# EAGLE design Hocki-Control (EAGLE 9.6.2)
Integrates sensors and microcontroller for battlebot Hocki
REVISION: 1.0; SCH_DESC: Control Board for Hocki Battlebot; TEAM: BattleBots

## Sheet 1 of 3: MCU, I/O, Power
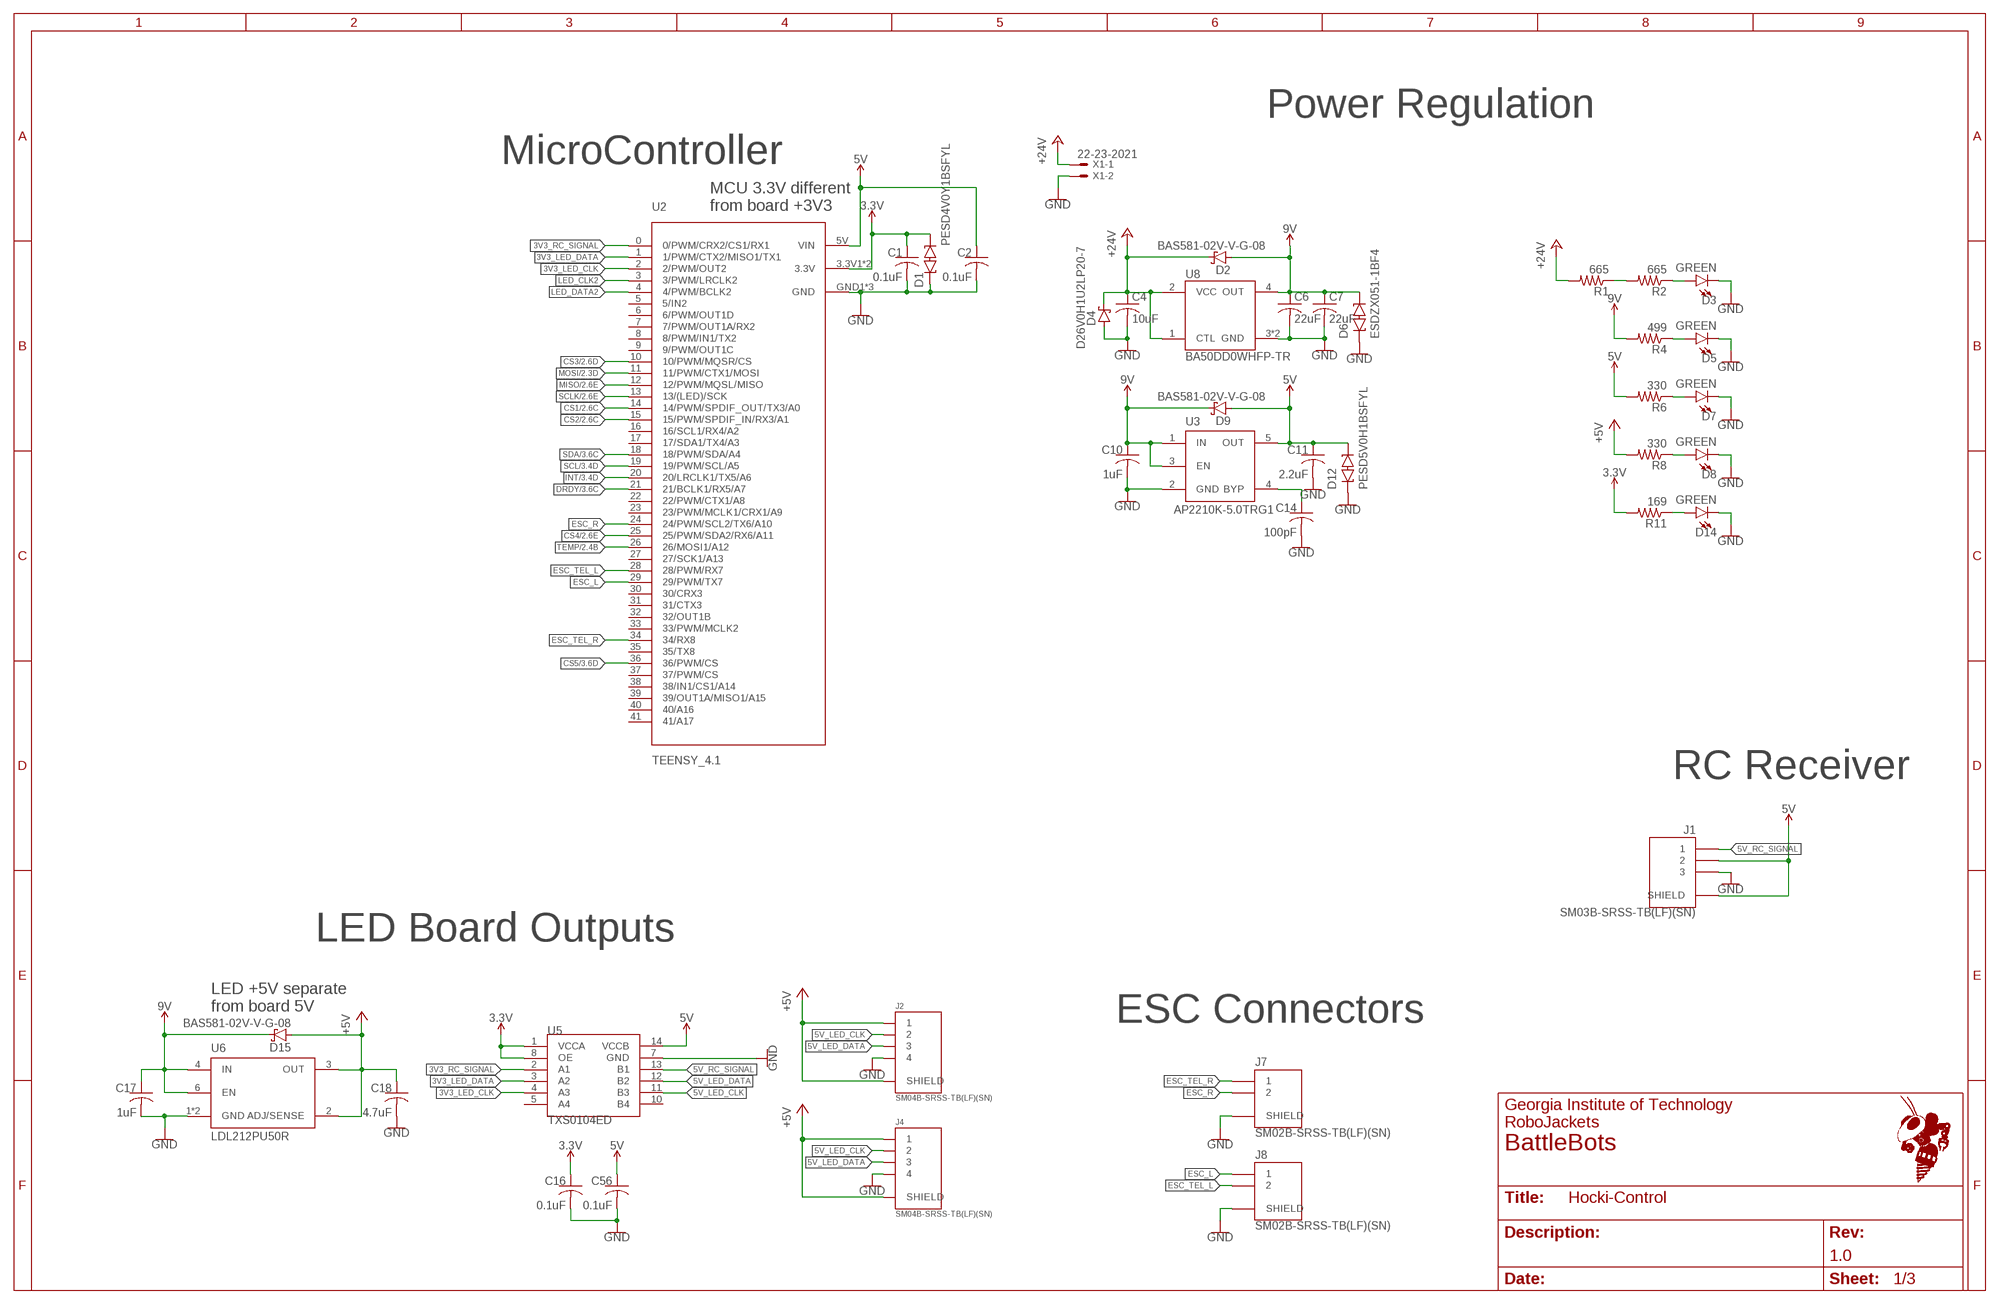
[diagram p0: schematic, sheet 1]

### Parts
C1  0.1uF  C-USC0603  [C0603]
C2  0.1uF  C-USC0603  [C0603]
C4  10uF  C-USC1206  [C1206]
C6  22uF  C-USC1206  [C1206]
C7  22uF  C-USC1206  [C1206]
C10  1uF  C-USC0603  [C0603]
C11  2.2uF  C-USC0603  [C0603]
C14  100pF  C-USC0603  [C0603]
C16  0.1uF  C-USC0603  [C0603]
C17  1uF  C-USC0603  [C0603]
C18  4.7uF  C-USC0603  [C0603]
C56  0.1uF  C-USC0603  [C0603]
D1  PESD4V0Y1BSFYL  [DSN0603-2]
D2  BAS581-02V-V-G-08  [SOD-523]
D3  GREEN  LED-GREEN0603  [LED-0603]
D4  D26V0H1U2LP20-7  [D26V0H1U2LP20-7]
D5  GREEN  LED-GREEN0603  [LED-0603]
D6  ESDZX051-1BF4  [DSN0603-2]
D7  GREEN  LED-GREEN0603  [LED-0603]
D8  GREEN  LED-GREEN0603  [LED-0603]
D9  BAS581-02V-V-G-08  [SOD-523]
D12  PESD5V0H1BSFYL  [DSN0603-2]
D14  GREEN  LED-GREEN0603  [LED-0603]
D15  BAS581-02V-V-G-08  [SOD-523]
J1  SM03B-SRSS-TB(LF)(SN)  [SM03B-SRSS-TB(LF)(SN)]
J2  SM04B-SRSS-TB(LF)(SN)  [SM04B-SRSS-TB(LF)(SN)]
J4  SM04B-SRSS-TB(LF)(SN)  [SM04B-SRSS-TB(LF)(SN)]
J7  SM02B-SRSS-TB(LF)(SN)  [SM02B-SRSS-TB(LF)(SN)]
J8  SM02B-SRSS-TB(LF)(SN)  [SM02B-SRSS-TB(LF)(SN)]
R1  665  R-US_R0603  [R0603]
R2  665  R-US_R0603  [R0603]
R4  499  R-US_R0603  [R0603]
R6  330  R-US_R0603  [R0603]
R8  330  R-US_R0603  [R0603]
R11  169  R-US_R0603  [R0603]
U2  TEENSY_4.1  [TEENSY_4.1]
U3  AP2210K-5.0TRG1  [SOT-23-5]
U5  TXS0104ED  [14-SOIC]
U6  LDL212PU50R  [DFN6(3X3)]
U8  BA50DD0WHFP-TR  [HRP5]
X1  22-23-2021  [22-23-2021]

### Nets
3.3V: C1.1 C16.1 D1.C2 R11.2 U2.3.3V1(3.3V) U2.3.3V2(3.3V) U5.1(VCCA) U5.8(OE) ; also sheet 2,3
3V3_LED_CLK: U2.2(2/PWM/OUT2) U5.4(A3)
3V3_LED_DATA: U2.1(1/PWM/CTX2/MISO1/TX1) U5.3(A2)
3V3_RC_SIGNAL: U2.0(0/PWM/CRX2/CS1/RX1) U5.2(A1)
5V: C2.1 C11.1 C56.1 D9.2(A) D12.C2 J1.2 J1.S1(SHIELD) J1.S2(SHIELD) R6.2 U2.5V(VIN) U3.5(OUT) U5.14(VCCB)
5V_LED_CLK: J2.2 J4.2 U5.11(B3)
5V_LED_DATA: J2.3 J4.3 U5.12(B2)
5V_RC_SIGNAL: J1.1 U5.13(B1)
9V: C6.1 C7.1 C10.1 C17.1 D2.2(A) D6.C2 D9.1(C) D15.1(C) R4.2 U3.1(IN) U3.3(EN) U6.4(IN) U6.6(EN) U8.4(OUT)
+5V: C18.1 D15.2(A) J2.1 J2.S1(SHIELD) J2.S2(SHIELD) J4.1 J4.S1(SHIELD) J4.S2(SHIELD) R8.2 U6.2(ADJ/SENSE) U6.3(OUT)
+24V: C4.1 D2.1(C) D4.1(C) R1.2 U8.1(CTL) U8.2(VCC) X1.1
CS1: U2.14(14/PWM/SPDIF_OUT/TX3/A0) ; also sheet 2
CS2: U2.15(15/PWM/SPDIF_IN/RX3/A1) ; also sheet 2
CS3: U2.10(10/PWM/MQSR/CS) ; also sheet 2
CS4: U2.25(25/PWM/SDA2/RX6/A11) ; also sheet 2
CS5: U2.36(36/PWM/CS) ; also sheet 3
DRDY: U2.21(21/BCLK1/RX5/A7) ; also sheet 3
ESC_L: J8.1 U2.29(29/PWM/TX7)
ESC_R: J7.2 U2.24(24/PWM/SCL2/TX6/A10)
ESC_TEL_L: J8.2 U2.28(28/PWM/RX7)
ESC_TEL_R: J7.1 U2.34(34/RX8)
GND: C1.2 C2.2 C4.2 C6.2 C7.2 C10.2 C11.2 C14.2 C16.2 C17.2 C18.2 C56.2 D1.C1 D3.C D4.2(A) D5.C D6.C1 D7.C D8.C D12.C1 D14.C J1.3 J2.4 J4.4 J7.S1(SHIELD) J7.S2(SHIELD) J8.S1(SHIELD) J8.S2(SHIELD) U2.GND1(GND) U2.GND2(GND) U2.GND3(GND) U3.2(GND) U5.7(GND) U6.1(GND) U6.7(GND) U8.3(GND) U8.6(GND) X1.2 ; also sheet 2,3
INT: U2.20(20/LRCLK1/TX5/A6) ; also sheet 3
LED_CLK2: U2.3(3/PWM/LRCLK2)
LED_DATA2: U2.4(4/PWM/BCLK2)
MISO: U2.12(12/PWM/MQSL/MISO) ; also sheet 2
MOSI: U2.11(11/PWM/CTX1/MOSI) ; also sheet 2
N$8: C14.1 U3.4(BYP)
N$14: D8.A R8.1
N$15: D7.A R6.1
N$18: D5.A R4.1
N$19: D3.A R2.1
N$20: R1.1 R2.2
N$27: D14.A R11.1
SCL: U2.19(19/PWM/SCL/A5) ; also sheet 3
SCLK: U2.13(13/(LED)/SCK) ; also sheet 2
SDA: U2.18(18/PWM/SDA/A4) ; also sheet 3
TEMP: U2.26(26/MOSI1/A12) ; also sheet 2
Unconnected: U2.5(5/IN2) U2.6(6/PWM/OUT1D) U2.7(7/PWM/OUT1A/RX2) U2.8(8/PWM/IN1/TX2) U2.9(9/PWM/OUT1C) U2.16(16/SCL1/RX4/A2) U2.17(17/SDA1/TX4/A3) U2.22(22/PWM/CTX1/A8) U2.23(23/PWM/MCLK1/CRX1/A9) U2.27(27/SCK1/A13) U2.30(30/CRX3) U2.31(31/CTX3) U2.32(32/OUT1B) U2.33(33/PWM/MCLK2) U2.35(35/TX8) U2.37(37/PWM/CS) U2.38(38/IN1/CS1/A14) U2.39(39/OUT1A/MISO1/A15) U2.40(40/A16) U2.41(41/A17) U5.5(A4) U5.10(B4)

### Notes on the sheet
- Power Regulation
- MicroController
- MCU 3.3V different
  from board +3V3
- RC Receiver
- LED Board Outputs
- LED +5V separate
  from board 5V
- ESC Connectors

## Sheet 2 of 3: Accelerometers
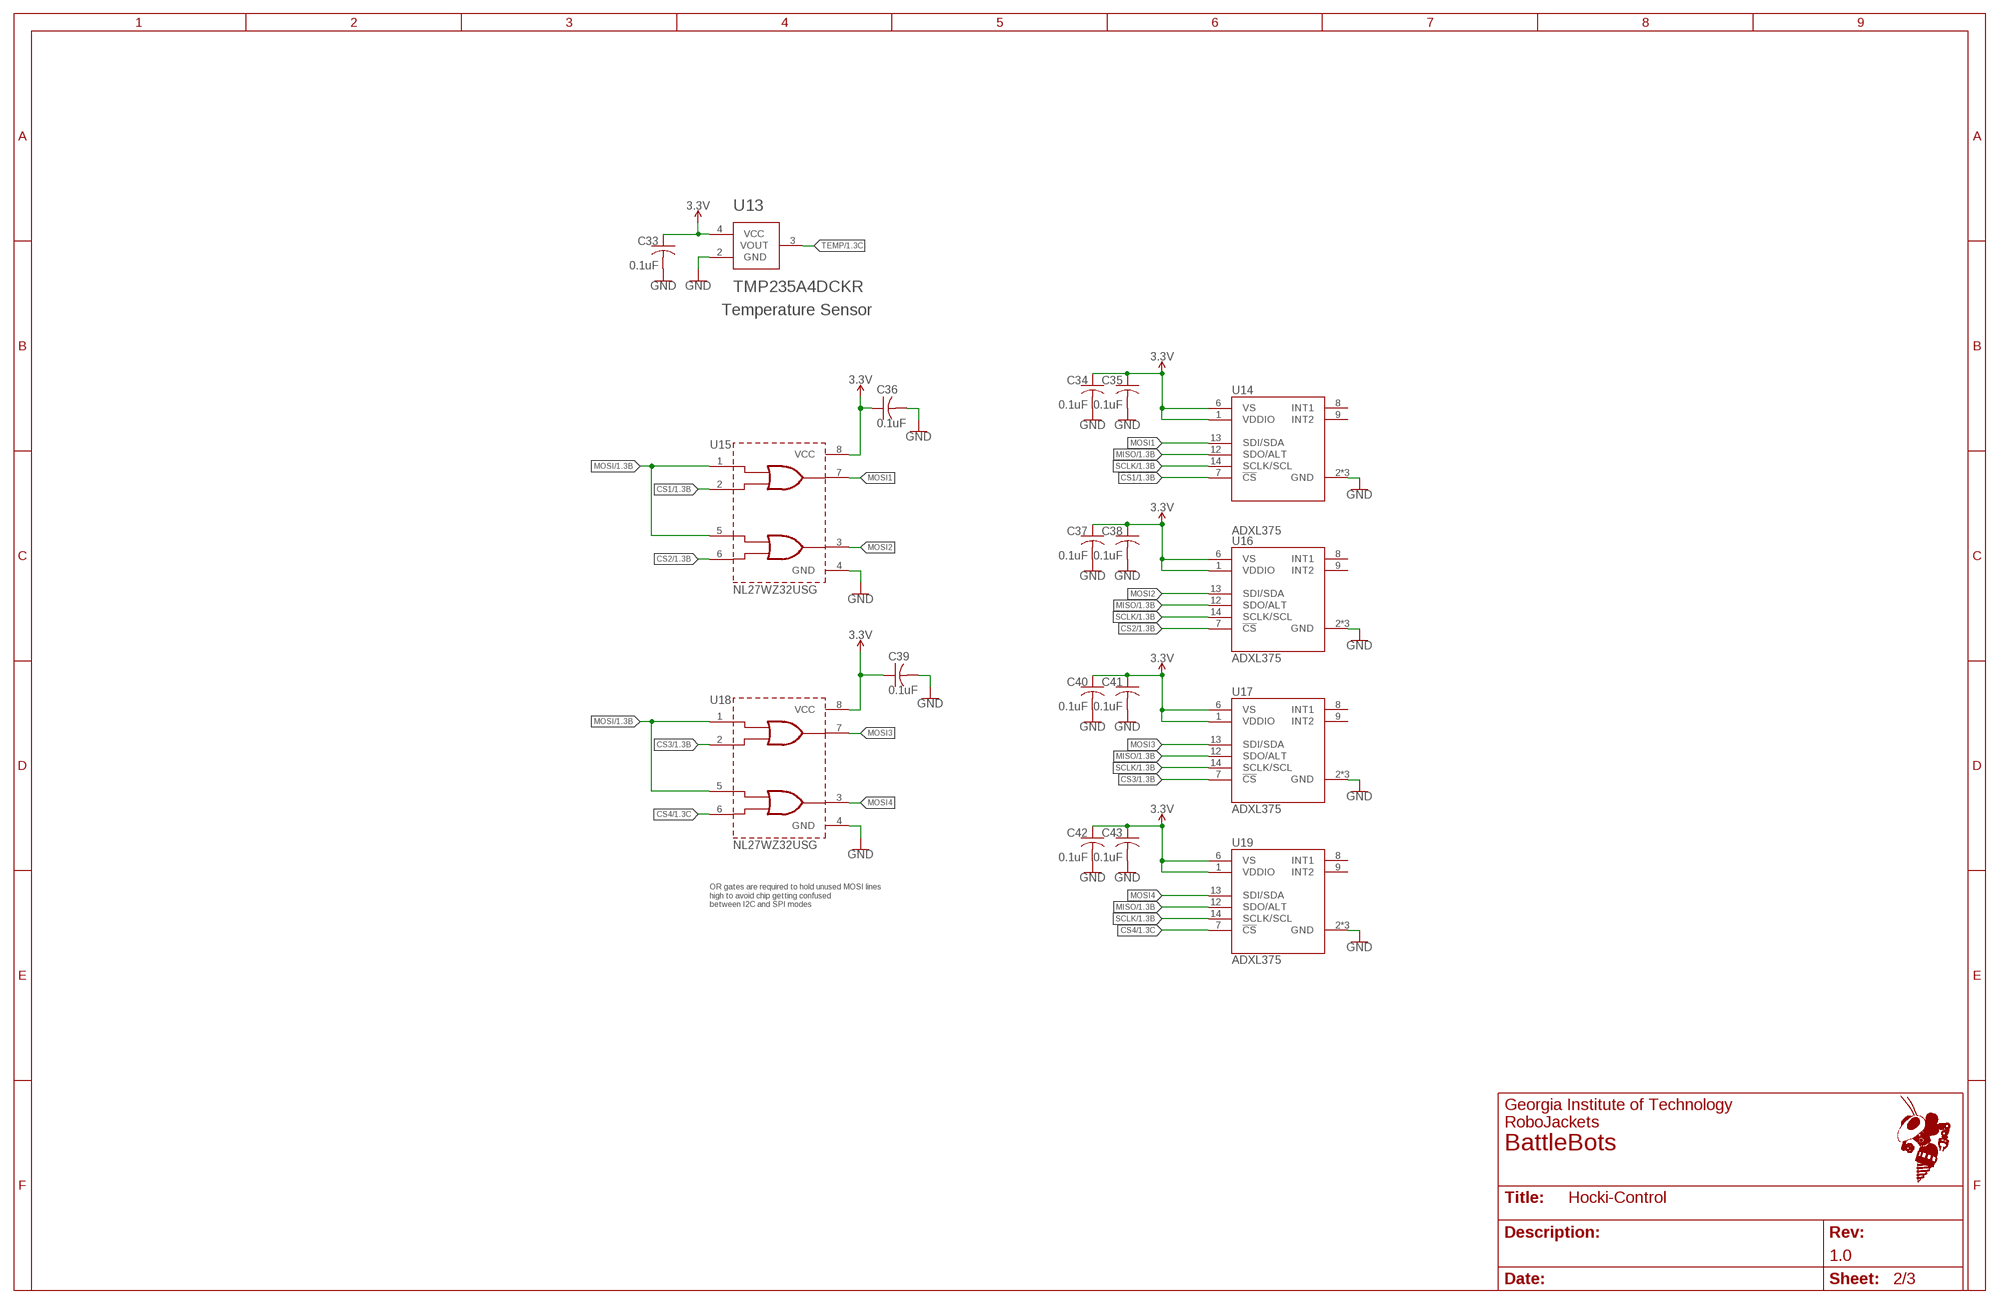
[diagram p1: schematic, sheet 2]

### Parts
C33  0.1uF  C-USC0603  [C0603]
C34  0.1uF  C-USC0603  [C0603]
C35  0.1uF  C-USC0603  [C0603]
C36  0.1uF  C-USC0603  [C0603]
C37  0.1uF  C-USC0603  [C0603]
C38  0.1uF  C-USC0603  [C0603]
C39  0.1uF  C-USC0603  [C0603]
C40  0.1uF  C-USC0603  [C0603]
C41  0.1uF  C-USC0603  [C0603]
C42  0.1uF  C-USC0603  [C0603]
C43  0.1uF  C-USC0603  [C0603]
U13  TMP235A4DCKR  [SOT-353]
U14  ADXL375  [14-LGA]
U15  NL27WZ32USG  [US8]
U16  ADXL375  [14-LGA]
U17  ADXL375  [14-LGA]
U18  NL27WZ32USG  [US8]
U19  ADXL375  [14-LGA]

### Nets
3.3V: C33.1 C34.1 C35.1 C36.1 C37.1 C38.1 C39.1 C40.1 C41.1 C42.1 C43.1 U13.4(VCC) U14.1(VDDIO) U14.6(VS) U15.8(VCC) U16.1(VDDIO) U16.6(VS) U17.1(VDDIO) U17.6(VS) U18.8(VCC) U19.1(VDDIO) U19.6(VS) ; also sheet 1,3
CS1: U14.7(!CS) U15.2(B1) ; also sheet 1
CS2: U15.6(B2) U16.7(!CS) ; also sheet 1
CS3: U17.7(!CS) U18.2(B1) ; also sheet 1
CS4: U18.6(B2) U19.7(!CS) ; also sheet 1
GND: C33.2 C34.2 C35.2 C36.2 C37.2 C38.2 C39.2 C40.2 C41.2 C42.2 C43.2 U13.2(GND) U14.2(GND) U14.4(GND) U14.5(GND) U15.4(GND) U16.2(GND) U16.4(GND) U16.5(GND) U17.2(GND) U17.4(GND) U17.5(GND) U18.4(GND) U19.2(GND) U19.4(GND) U19.5(GND) ; also sheet 1,3
MISO: U14.12(SDO/ALT) U16.12(SDO/ALT) U17.12(SDO/ALT) U19.12(SDO/ALT) ; also sheet 1
MOSI: U15.1(A1) U15.5(A2) U18.1(A1) U18.5(A2) ; also sheet 1
MOSI1: U14.13(SDI/SDA) U15.7(Y1)
MOSI2: U15.3(Y2) U16.13(SDI/SDA)
MOSI3: U17.13(SDI/SDA) U18.7(Y1)
MOSI4: U18.3(Y2) U19.13(SDI/SDA)
SCLK: U14.14(SCLK/SCL) U16.14(SCLK/SCL) U17.14(SCLK/SCL) U19.14(SCLK/SCL) ; also sheet 1
TEMP: U13.3(VOUT) ; also sheet 1
Unconnected: U14.8(INT1) U14.9(INT2) U16.8(INT1) U16.9(INT2) U17.8(INT1) U17.9(INT2) U19.8(INT1) U19.9(INT2)

### Notes on the sheet
- Temperature Sensor
- OR gates are required to hold unused MOSI lines 
  high to avoid chip getting confused 
  between I2C and SPI modes

## Sheet 3 of 3: Magnetometer
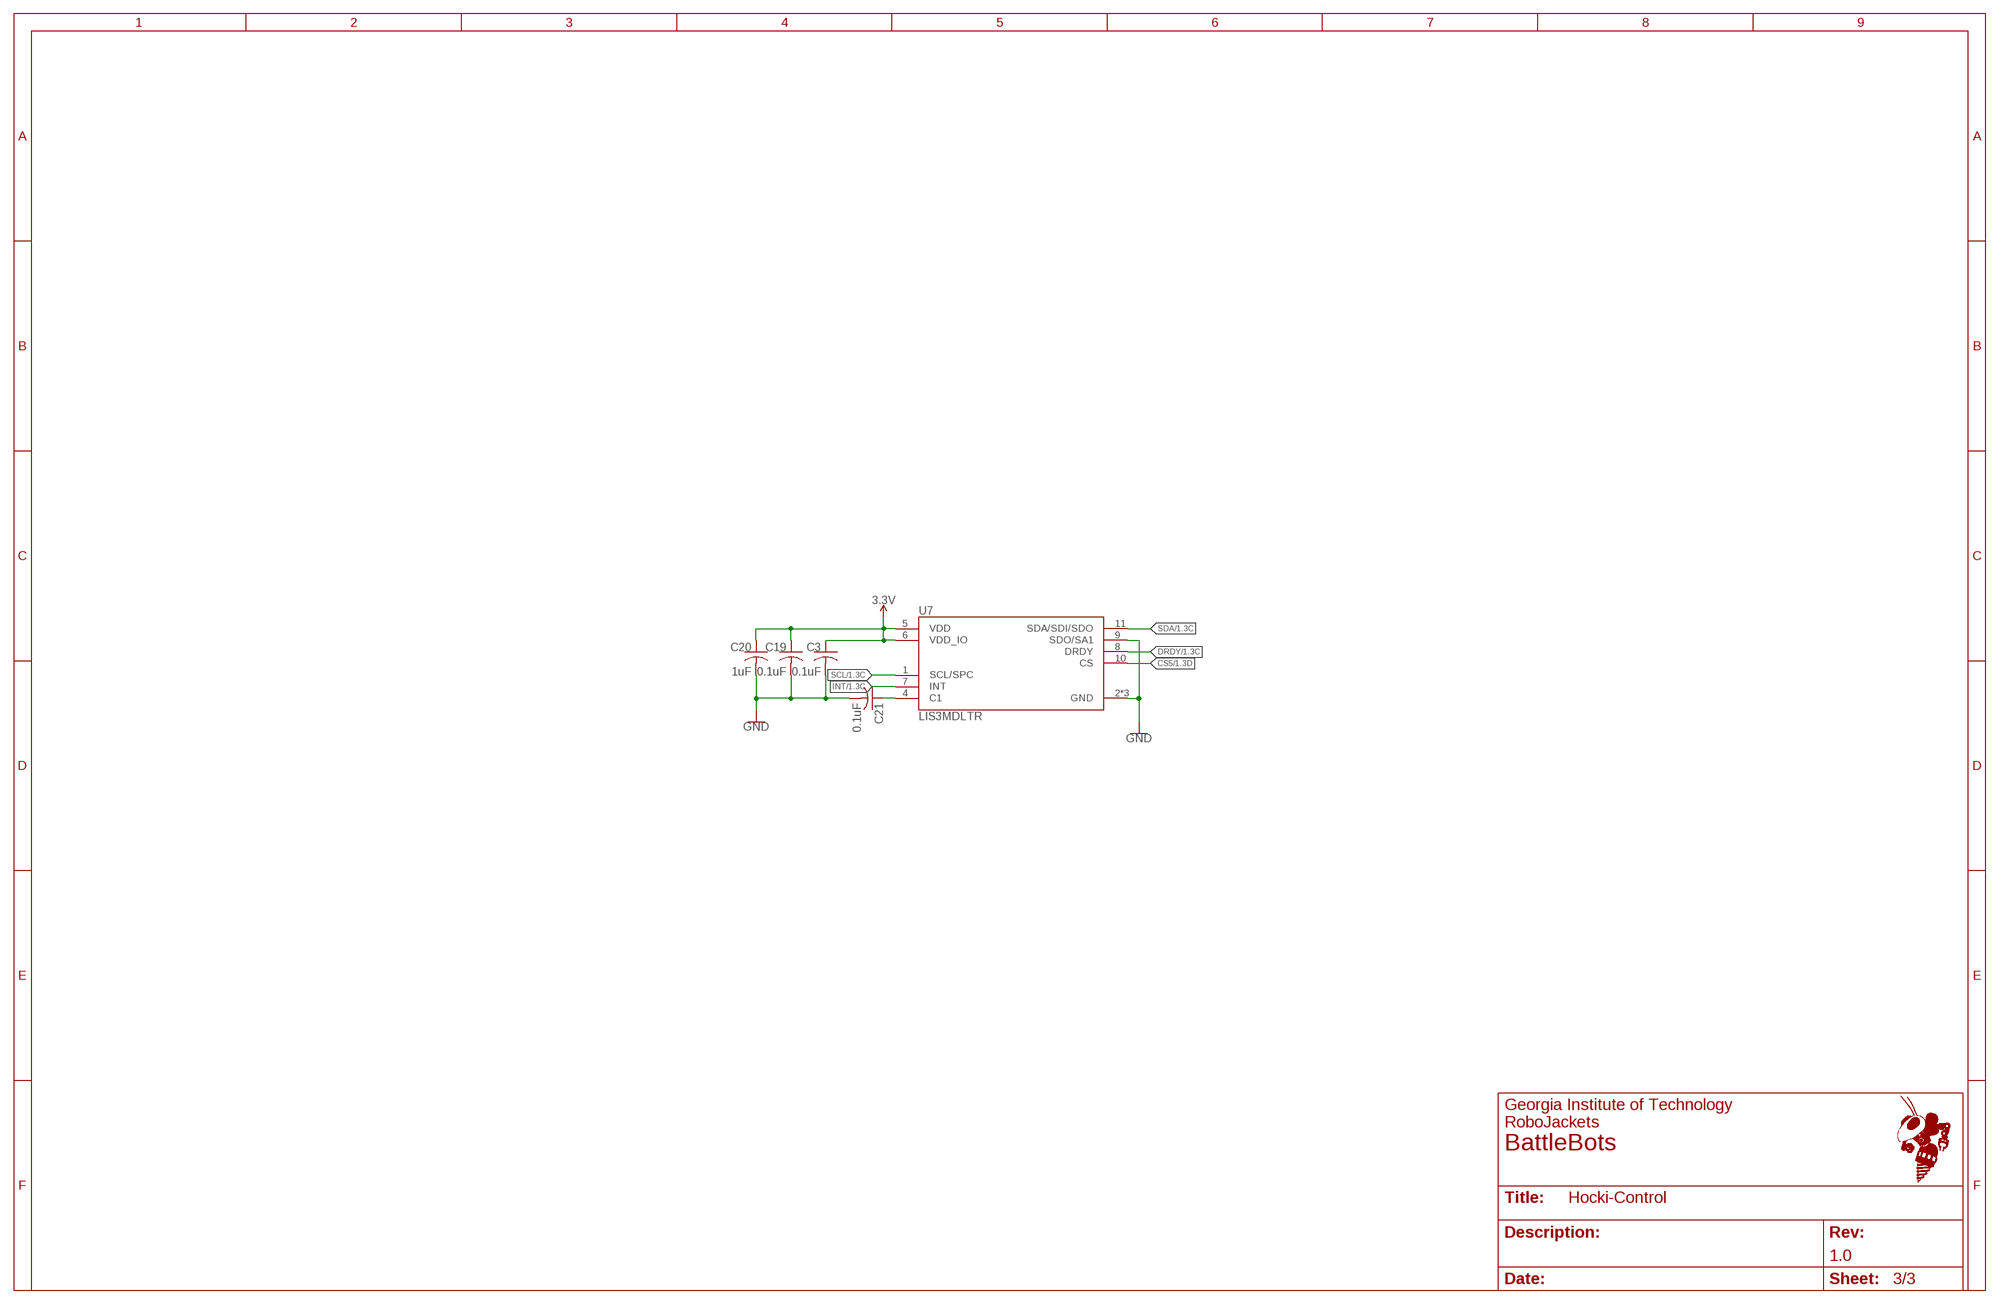
[diagram p2: schematic, sheet 3]

### Parts
C3  0.1uF  C-USC0603  [C0603]
C19  0.1uF  C-USC0603  [C0603]
C20  1uF  C-USC0603  [C0603]
C21  0.1uF  C-USC0603  [C0603]
U7  LIS3MDLTR  [LGA-12_2X2X1_STM]

### Nets
3.3V: C3.1 C19.1 C20.1 U7.5(VDD) U7.6(VDD_IO) ; also sheet 1,2
CS5: U7.10(CS) ; also sheet 1
DRDY: U7.8(DRDY) ; also sheet 1
GND: C3.2 C19.2 C20.2 C21.2 U7.2(GND) U7.3(GND) U7.9(SDO/SA1) U7.12(GND) ; also sheet 1,2
INT: U7.7(INT) ; also sheet 1
N$5: C21.1 U7.4(C1)
SCL: U7.1(SCL/SPC) ; also sheet 1
SDA: U7.11(SDA/SDI/SDO) ; also sheet 1

## Library data of the parts
C1-C4 C6 C7 C10 C11 C14 C16-C21 C33-C43 C56 = rcl:C-US: CAPACITOR, American symbol; SPICEPREFIX: C
D1 = Hocki_Library:PESD4V0Y1BSFYL: 3.7V (Typ) Clamp Ipp Tvs Diode Surface Mount DSN0603-2 DigiKey <https://www.digikey.com/product-detail/en/nexperia-usa-inc/PESD4V0Y1BSFYL/1727-7840-1-ND/9326518>; DKPN: 1727-7840-1-ND
D2 D9 D15 = Hocki_Library:BAS581-02V-V-G-08: Diode Schottky 40V 200mA Surface Mount SOD-523 DigiKey <https://www.digikey.com/product-detail/en/vishay-semiconductor-diodes-division/BAS581-02V-V-G-08/112-BAS581-02V-V-G-08CT-ND/8564684>; DKPN: 112-BAS581-02V-V-G-08CT-ND
D3 D5 D7 D8 D14 = SparkFun-LED:LED-GREEN: Green SMD LED Used in manufacturing of various products at SparkFun Packages: 0603 - SMD 0603 package [Product Link] <http://www.futureelectronics.com/en/technologies/semiconductors/optoelectronics/leds/Pages/9894312-LTST-C190GKT.aspx?CrossPart=HSMG-C190&IM=0> LilyPad 1206 - SMD1206 LilyPad package [Product Link] <http://www.futureelectronics.com/en/Technologies/Product.aspx?ProductID=IN150NGHARVATEKCORPORATION2049943&IM=0> 1206 - SMD1206 package [Product Link] <http://www.futureelectronics.com/en/technologies/semiconductors/optoelectronics/leds/Pages/8315665-LTST-C150KGKT.aspx?IM=0> 1206 Bottom Mount -SMD 1206 Bottom Mount [Product Link] <http://www.digikey.com/product-detail/en/lite-on-inc/LTST-C230KGKT/160-1456-1-ND/386854> SparkFun Products: Pro Mini 328 -5V <https://www.sparkfun.com/products/821> RedBoard <https://www.sparkfun.com/products/12757> MP3 Trigger <https://www.sparkfun.com/products/13720> Makey Makey <https://www.sparkfun.com/products/11076>; PROD_ID: DIO-00821
D4 = Hocki_Library:D26V0H1U2LP20-7: 40V Clamp 9.5A Ipp Tvs Diode Surface Mount U-DFN2020-2 DigiKey <https://www.digikey.com/product-detail/en/diodes-incorporated/D26V0H1U2LP20-7/D26V0H1U2LP20-7DICT-ND/4898881>
D6 = Hocki_Library:ESDZX051-1BF4: 10V (Typ) Clamp 4A (8/20µs) Ipp Tvs Diode Surface Mount ST0201 DigiKey <https://www.digikey.com/product-detail/en/stmicroelectronics/ESDZX051-1BF4/497-ESDZX051-1BF4CT-ND/12749584>; DKPN: 497-ESDZX051-1BF4CT-ND
D12 = Hocki_Library:PESD5V0H1BSFYL: 5V Clamp 7A (8/20µs) Ipp Tvs Diode Surface Mount DSN0603-2 DigiKey <https://www.digikey.com/product-detail/en/nexperia-usa-inc/PESD5V0H1BSFYL/1727-2675-1-ND/6576108>; DKPN: 1727-2675-1-ND
J1 = Hocki_Library:SM03B-SRSS-TB(LF)(SN): Connector Header Surface Mount, Right Angle 3 position 0.039" (1.00mm) DigiKey <https://www.digikey.com/product-detail/en/jst-sales-america-inc/SM03B-SRSS-TB-LF-SN/455-1803-1-ND/926874>; DKPN: 455-1803-1-ND
J2 J4 = Hocki_Library:SM04B-SRSS-TB(LF)(SN): Connector Header Surface Mount, Right Angle 4 position 0.039" (1.00mm) DigiKey <https://www.digikey.com/product-detail/en/jst-sales-america-inc/SM04B-SRSS-TB-LF-SN/455-1804-1-ND/926875>; DKPN: 455-1804-1-ND
J7 J8 = Hocki_Library:SM02B-SRSS-TB(LF)(SN): Connector Header Surface Mount, Right Angle 2 position 0.039" (1.00mm) DigiKey <https://www.digikey.com/product-detail/en/jst-sales-america-inc/SM02B-SRSS-TB-LF-SN/455-1802-1-ND/926873>; DKPN: 455-1802-1-ND
R1 R2 R4 R6 R8 R11 = rcl:R-US_: RESISTOR, American symbol; SPICEPREFIX: R
U2 = Hocki_Library:TEENSY_4.1: Teensy 4.1 features the fastest micocontroller and an expanded set of powerful peripherals in a 2.4 by 0.7 inch form factor. DigiKey <https://www.digikey.com/product-detail/en/sparkfun-electronics/DEV-16771/1568-DEV-16771-ND/12180099>; DKPN: 1568-DEV-16771-ND
U3 = Hocki_Library:AP2210K-*TRG1: Linear Voltage Regulator IC 1 Output 300mA SOT-23-5 3.3V DigiKey <https://www.digikey.com/product-detail/en/diodes-incorporated/AP2210K-3-3TRG1/AP2210K-3-3TRG1DICT-ND/4505291> 5.0V DigiKey <https://www.digikey.com/product-detail/en/diodes-incorporated/AP2210K-5-0TRG1/AP2210K-5-0TRG1DICT-ND/4505292>; DKPN: AP2210K-5.0TRG1DICT-ND
U5 = Hocki_Library:TXS0104ED: Translator 1 Circuit, 4 Channel Bidirectional DigiKey <https://www.digikey.com/en/products/detail/texas-instruments/TXS0104ED/1910175>; DKPN: 296-34699-5-ND
U6 = Hocki_Library:LDL212PU50R: Linear Voltage Regulator IC 1 Output 1.2A 6-DFN (3x3) DigiKey <https://www.digikey.com/product-detail/en/stmicroelectronics/LDL212PU50R/497-16897-1-ND/6230213>; DKPN: 497-16897-1-ND
U7 = Hocki_Library:LIS3MDLTR: Magnetoresistive Sensor X, Y, Z Axis 12-LGA (2x2) https://www.st.com/content/ccc/resource/technical/document/datasheet/54/2a/85/76/e3/97/42/18/DM00075867.pdf/files/DM00075867.pdf/jcr:content/translations/en.DM00075867.pdf; DKPN: 497-13892-1-ND
U8 = Hocki_Library:BA50DD0WHFP-TR: Linear Regulator 9V 2A Fixed Datasheet <https://fscdn.rohm.com/en/products/databook/datasheet/ic/power/linear_regulator/baxxdd0-e.pdf>; DKPN: BA90DD0WHFPCT-ND
U13 = Hocki_Library:TMP235A4DCKR: Temperature Sensor Analog, Local -40°C ~ 150°C 10mV/°C SC-70-5 DigiKey <https://www.digikey.com/product-detail/en/texas-instruments/TMP235A4DCKR/296-50016-1-ND/9462854>
U14 U16 U17 U19 = Hocki_Library:ADXL375: Accelerometer X, Y, Z Axis ±200g 0.05Hz ~ 1.6kHz 14-LGA (3x5) DigiKey <https://www.digikey.com/product-detail/en/analog-devices-inc/ADXL375BCCZ-RL7/ADXL375BCCZ-RL7CT-ND/4376405>; DKPN: ADXL375BCCZ-RL7CT-ND
U15 U18 = Hocki_Library:NL27WZ32USG: OR Gate IC 2 Channel US8 DigiKey <https://www.digikey.com/product-detail/en/on-semiconductor/NL27WZ32USG/NL27WZ32USGOSCT-ND/964591>; DKPN: NL27WZ32USGOSCT-ND
X1 = con-molex:22-23-2021: .100" (2.54mm) Center Header - 2 Pin; MF: MOLEX; MPN: 22-23-2021; OC_FARNELL: 1462926; OC_NEWARK: 25C3832

## Board
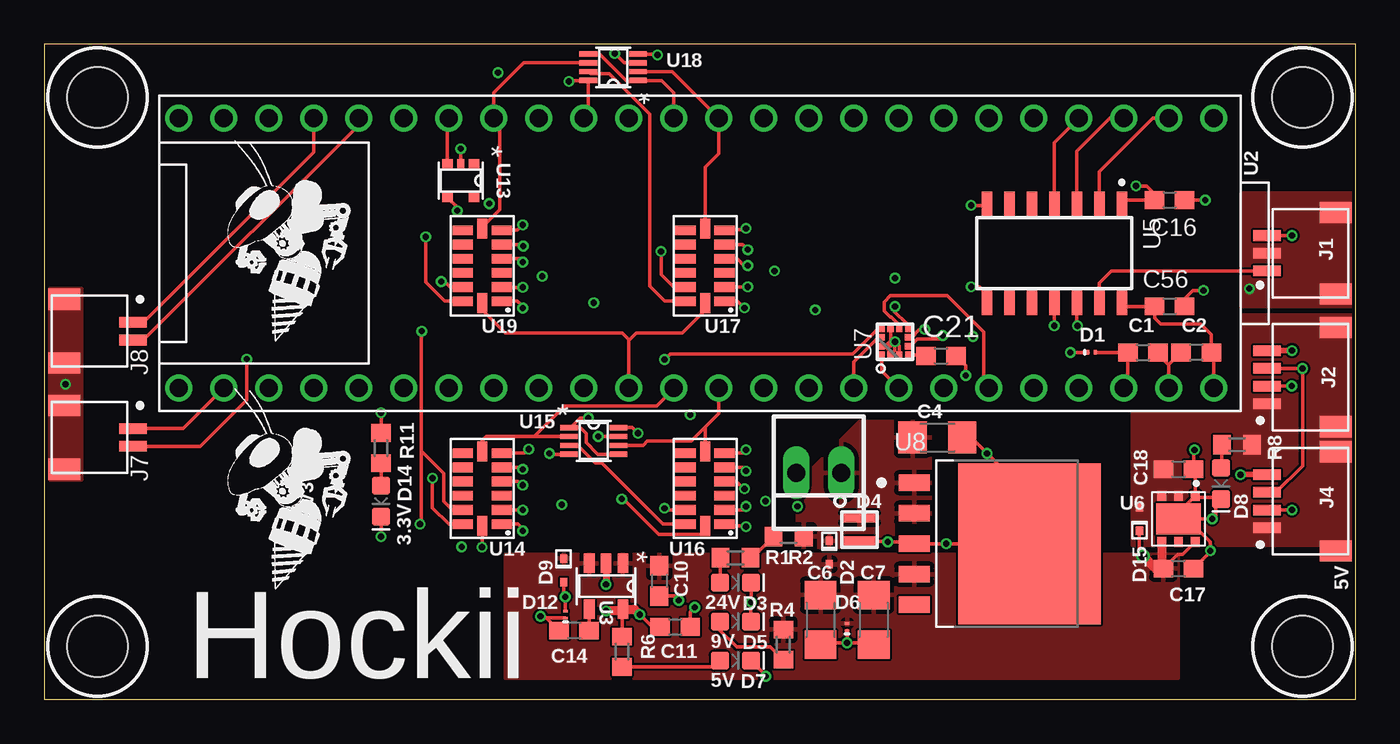
[diagram p3: board, top side]
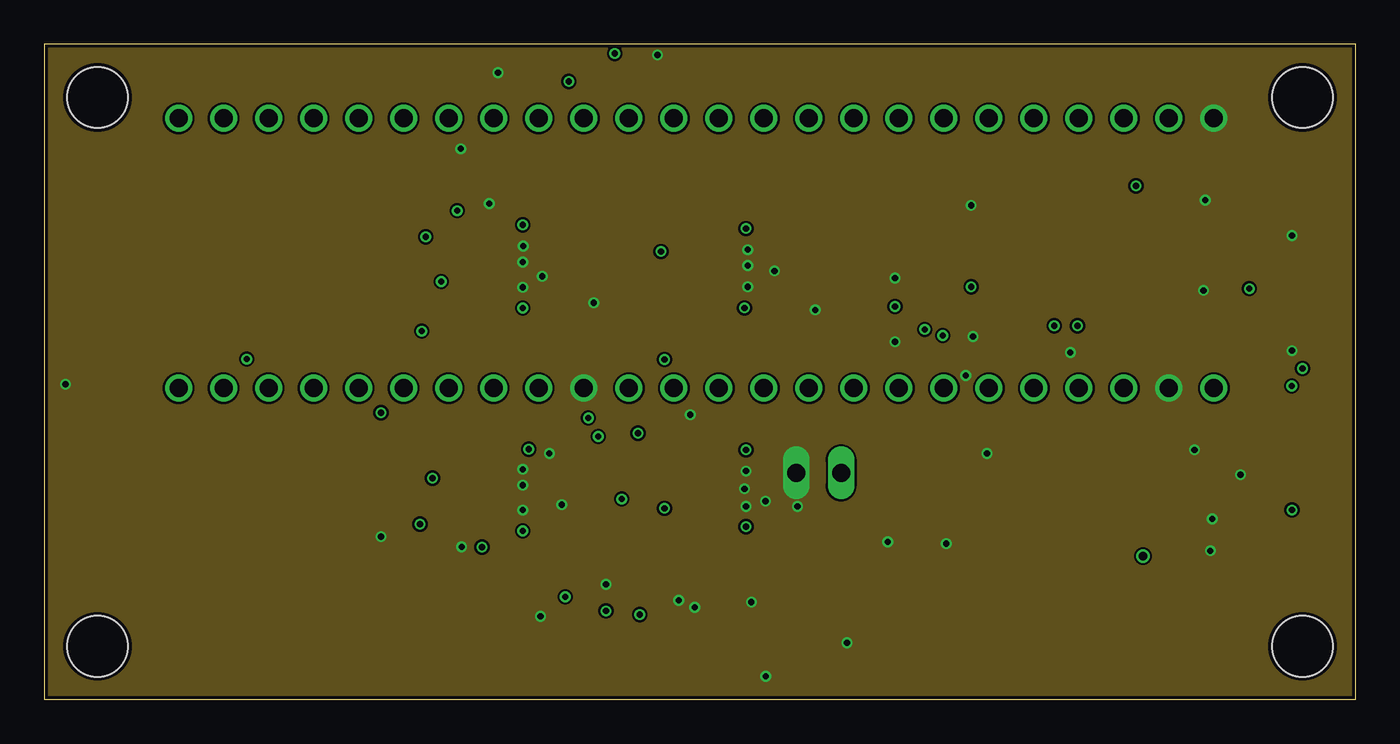
[diagram p4: board, inner layer GND]
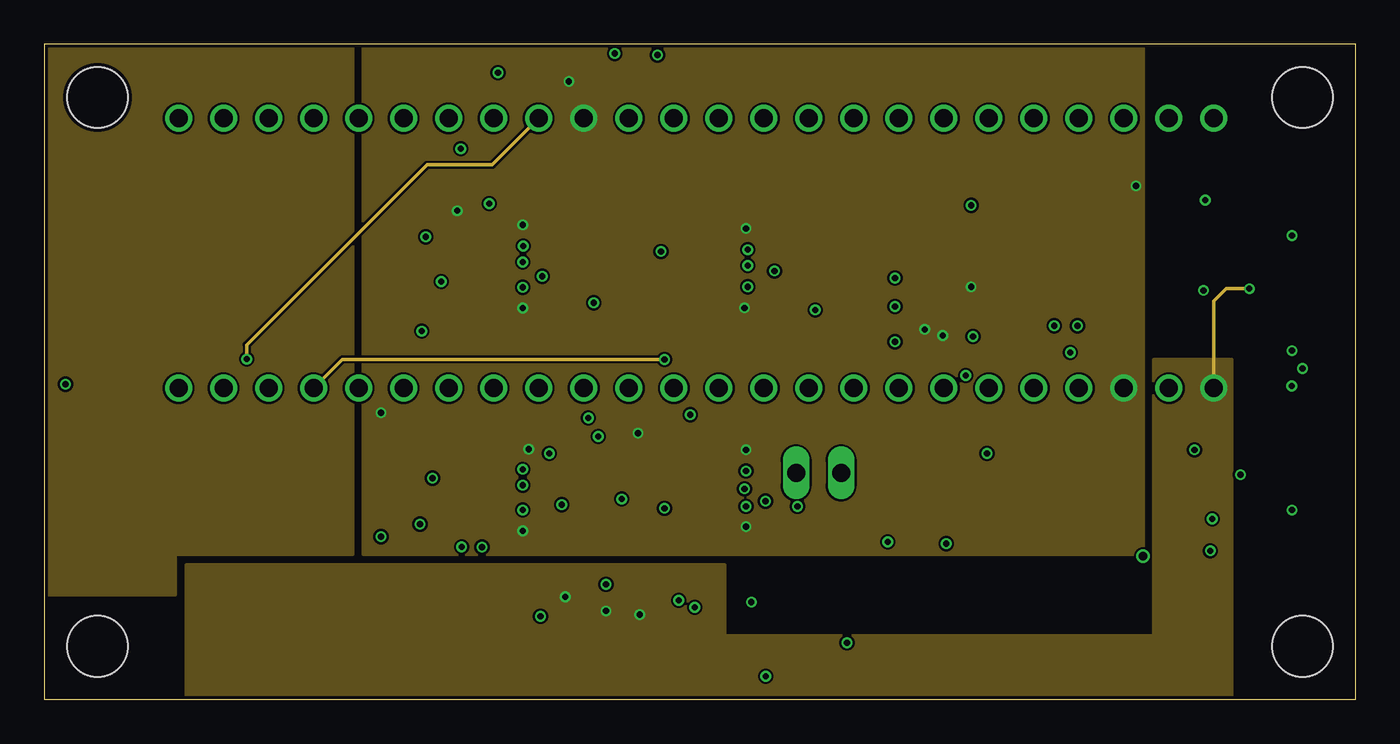
[diagram p5: board, inner layer Power]
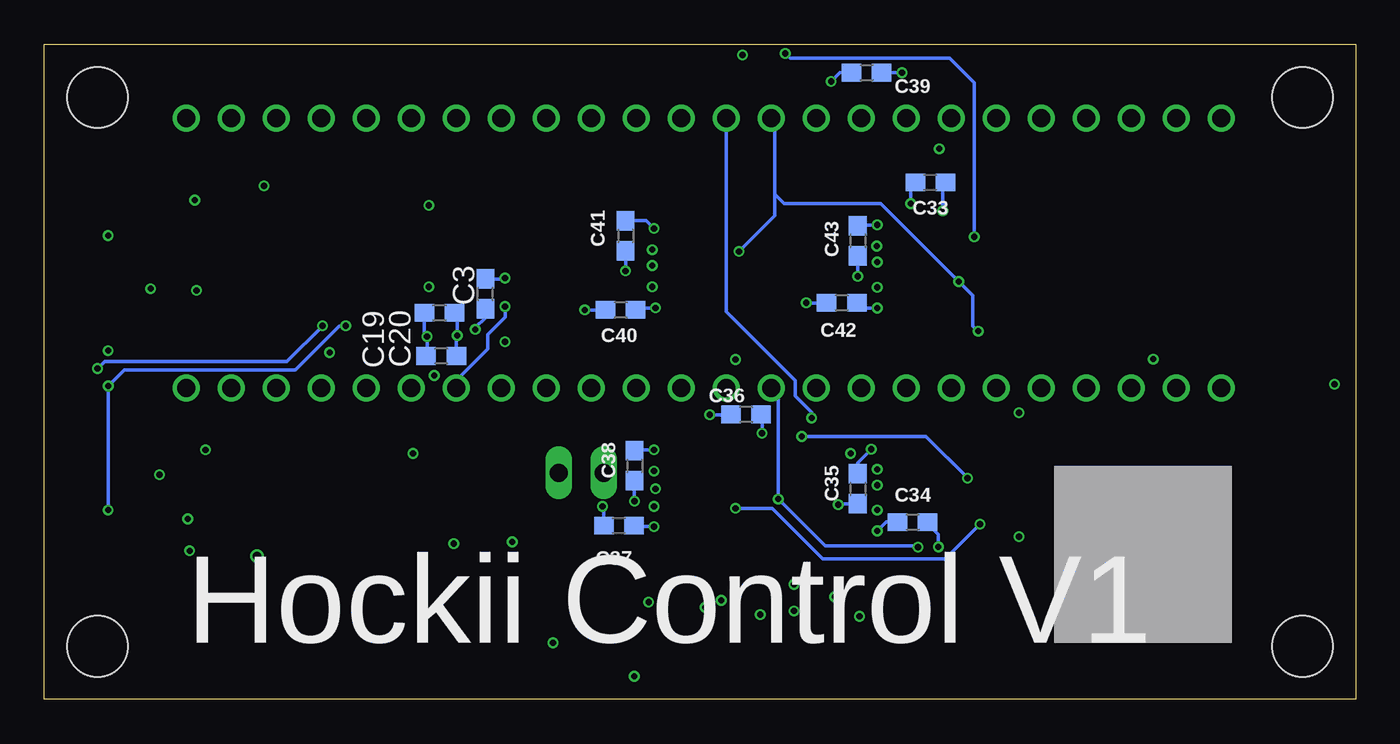
[diagram p6: board, bottom side, seen from below]

Size 74 x 37 mm. Coordinates in mm from the lower left corner, seen from the top.
Outline: 0,37 0,0 74,0 74,37 0,37
Copper layers (1+2*15+16): Top 0.035mm / dielectric 0.2mm / GND 0.0175mm / dielectric 1.065mm / Power 0.0175mm / dielectric 0.2mm / Bottom 0.035mm
Design rules "JLCPCB (4 Layer)": minimum track width 5mil, minimum drill 0.2mm, track to track 5mil, track to pad 5mil, pad to pad 5mil, via to via 20mil, smd to smd 5mil, copper to edge 0.2mm, drill to drill 21mil, minimum pad ring 6mil, minimum via ring 5mil, stop-mask expansion 6mil, vias tented up to drill 30mil, thermal gap 10mil
Holes 3.45 mm at 71,34 71,3 3,3 3,34

### Footprints (pad centres in the part's own frame; a part is rotated, then mirrored left to right if it is on the bottom)
C0603 = smd 1.1 x 1: 1 -0.85,0; 2 0.85,0
C1206 = smd 1.6 x 1.8: 1 -1.4,0; 2 1.4,0
DSN0603-2 = smd 0.15 x 0.25: C1 -0.2,0; C2 0.2,0
SOD-523 = smd 0.48 x 0.4: 1 -0.66,0; 2 0.66,0
LED-0603 = smd 1 x 1: A -0.877,0; C 0.877,0
D26V0H1U2LP20-7 = smd 0.55 x 1.9: 1 -0.675,0; 2 0.675,0
SM03B-SRSS-TB(LF)(SN) = smd 0.6 x 1.55: 1 -1,0; 2 0,0; 3 1,0 | smd 1.2 x 1.8: S1 -2.3,-3.875; S2 2.3,-3.875
SM04B-SRSS-TB(LF)(SN) = smd 0.6 x 1.55: 1 -1.5,0; 2 -0.5,0; 3 0.5,0; 4 1.5,0 | smd 1.2 x 1.8: S1 -2.8,-3.875; S2 2.8,-3.875
SM02B-SRSS-TB(LF)(SN) = smd 0.6 x 1.55: 1 -0.5,0; 2 0.5,0 | smd 1.2 x 1.8: S1 -1.8,-3.875; S2 1.8,-3.875
R0603 = smd 1 x 1.1: 1 -0.85,0; 2 0.85,0
TEENSY_4.1 = drill 1.016: 0 -7.62,27.46; 1 -7.62,24.92; 2 -7.62,22.38; 3 -7.62,19.84; 3.3V1 -7.62,-5.56; 3.3V2 7.62,24.92; 4 -7.62,17.3; 5 -7.62,14.76; 5V 7.62,30; 6 -7.62,12.22; 7 -7.62,9.68; 8 -7.62,7.14; 9 -7.62,4.6; 10 -7.62,2.06; 11 -7.62,-0.48; 12 -7.62,-3.02; 13 7.62,-3.02; 14 7.62,-0.48; 15 7.62,2.06; 16 7.62,4.6; 17 7.62,7.14; 18 7.62,9.68; 19 7.62,12.22; 20 7.62,14.76; 21 7.62,17.3; 22 7.62,19.84; 23 7.62,22.38; 24 -7.62,-8.1; 25 -7.62,-10.64; 26 -7.62,-13.18; 27 -7.62,-15.72; 28 -7.62,-18.26; 29 -7.62,-20.8; 30 -7.62,-23.34; 31 -7.62,-25.88; 32 -7.62,-28.42; 33 7.62,-28.42; 34 7.62,-25.88; 35 7.62,-23.34; 36 7.62,-20.8; 37 7.62,-18.26; 38 7.62,-15.72; 39 7.62,-13.18; 40 7.62,-10.64; 41 7.62,-8.1; GND1 -7.62,30; GND2 7.62,27.46; GND3 7.62,-5.56
SOT-23-5 = smd 1.1 x 0.6: 1 -1.3,0.95; 2 -1.3,0; 3 -1.3,-0.95; 4 1.3,-0.95; 5 1.3,0.95
14-SOIC = smd 1.55 x 0.6: 1 -2.7,3.81; 2 -2.7,2.54; 3 -2.7,1.27; 4 -2.7,0; 5 -2.7,-1.27; 6 -2.7,-2.54; 7 -2.7,-3.81; 8 2.7,-3.81; 9 2.7,-2.54; 10 2.7,-1.27; 11 2.7,0; 12 2.7,1.27; 13 2.7,2.54; 14 2.7,3.81
DFN6(3X3) = smd 0.55 x 0.5: 1 -1.3,0.95; 2 -1.3,0; 3 -1.3,-0.95; 4 1.3,-0.95; 5 1.3,0; 6 1.3,0.95 | smd 1.75 x 2.5: 7 0,0
LGA-12_2X2X1_STM = smd 0.377 x 0.352: 1 -0.75,0.75; 2 -0.75,0.25; 3 -0.75,-0.25; 4 -0.75,-0.75; 7 0.75,-0.75; 8 0.75,-0.25; 9 0.75,0.25; 10 0.75,0.75 | smd 0.352 x 0.377: 5 -0.25,-0.75; 6 0.25,-0.75; 11 0.25,0.75; 12 -0.25,0.75
HRP5 = smd 1.77 x 0.92: 1 -4.81,3.44; 2 -4.81,1.72; 3 -4.81,0; 4 -4.81,-1.72; 5 -4.81,-3.44 | smd 8.02 x 9.09: 6 1.69,0
SOT-353 = smd 0.6 x 0.6: 1 -0.9,0.75; 3 -0.9,-0.75; 4 0.9,-0.75; 5 0.9,0.75 | smd 0.6 x 0.4: 2 -0.9,0
14-LGA = smd 1.145 x 0.55: 1 -1.1,2; 2 -1.1,1.2; 3 -1.1,0.4; 4 -1.1,-0.4; 5 -1.1,-1.2; 6 -1.1,-2; 8 1.1,-2; 9 1.1,-1.2; 10 1.1,-0.4; 11 1.1,0.4; 12 1.1,1.2; 13 1.1,2 | smd 0.55 x 1.145: 7 0,-2.1; 14 0,2.1
US8 = smd 1 x 0.3: 1 -1.4,0.75; 2 -1.4,0.25; 3 -1.4,-0.25; 4 -1.4,-0.75; 5 1.4,-0.75; 6 1.4,-0.25; 7 1.4,0.25; 8 1.4,0.75
22-23-2021 = drill 1 long: 1 -1.27,0; 2 1.27,0

### Placement (x,y rotation side)
C1  62,19.6 0 top
C2  65,19.6 180 top
C3  49.1,22.9 90 bottom
C4  50.4,14.8 0 top
C6  43.8,4.5 270 top
C7  46.8,4.5 270 top
C10  34.7,6.7 270 top
C11  35.6,4.1 0 top
C14  29.9,3.9 180 top
C16  63.5,28.2 0 top
C17  64,7.4 0 top
C18  64,13 0 top
C19  51.7,21.84 180 bottom
C20  51.6,19.4 180 bottom
C21  50.6,19.4 0 top
C33  24,29.2 180 bottom
C34  25,10.02 0 bottom
C35  28.1,11.9 270 bottom
C36  34.4,16.1 180 bottom
C37  41.58,9.82 180 bottom
C38  40.7,13.2 270 bottom
C39  27.6,35.4 0 bottom
C40  41.48,22 180 bottom
C41  41.2,26.18 270 bottom
C42  29,22.4 180 bottom
C43  28.1,25.9 270 bottom
C56  63.5,22.2 0 top
D1  59.1,19.6 0 top
D2  44.3,8.3 270 top
D3  39,6.6 0 top
D4  46,9.6 270 top
D5  39,4.4 0 top
D6  45.3,4.1 90 top
D7  39,2.2 0 top
D8  66.4,12.2 270 top
D9  29.3,7.3 270 top
D12  29.4,4.8 90 top
D14  19,11.2 270 top
D15  61.8,10.2 90 top
J1  69,25.2 90 top
J2  69,18.2 90 top
J4  69,11.2 90 top
J7  5,14.8 270 top
J8  5,20.8 270 top
R1  42,9.2 0 top
R2  39,8 0 top
R4  41.7,3.1 90 top
R6  32.6,2.7 90 top
R8  67.3,14.4 0 top
R11  19,14.2 90 top
U2  36,25.2 270 top
U3  31.7,6.4 270 top
U5  57,25.2 270 top
U6  64,10.2 270 top
U7  48,20.2 90 top
U8  53.9,8.8 0 top
U13  23.5,29.3 270 top
U14  24.71,11.91 180 top
U15  31,14.6 0 top
U16  37.29,11.91 180 top
U17  37.29,24.49 180 top
U18  32.1,35.7 180 top
U19  24.71,24.49 180 top
U$1  [ROBOBUZZ_0.6X]  13,6.2 0 top
U$2  [ROBOBUZZ_0.6X]  13,20.2 0 top
X1  43.7,12.8 180 top

### Tracks (layer width: path | path; a pad name or v marks a point on that pad's centre or on a via)
3.3V  (via drill 0.35)
  Top 0.2: v33.5,15.04 33.19,15.35 U15.8 | v39.6,9.77 39.56,9.81 38.49,9.81 U16.1 | R11.2 v19,16.2 | D1.C2 C1.1 61.15,17.81 U2.3.3V2 | U13.4 22.75,28.35 23.3,27.8 v23.3,27.6 | v39.6,14.1 39.41,13.91 U16.6 | v27.34,14.14 27.11,13.91 U14.6 | v39.51,22.11 39.11,22.51 38.41,22.51 U17.1 | v39.6,26.6 39.53,26.53 38.43,26.53 U17.6 | v27,22.1 27,22.2 26.7,22.5 U19.1 | U19.6 25.83,26.47 25.86,26.5 26.7,26.5 v27,26.8 | v29.6,34.9 29.65,34.95 U18.8 30.7,33 30.52,32.82 U2.3.3V1 | U14.1 26.71,9.91 27,9.62 v27,9.52 | U5.1 61.11,28.2 C16.1 62.65,28.55 62.2,29 v61.6,29 | U5.8 53.19,22.9 52.79,23.3 v52.3,23.3 | v49.68,20.9 49.38,20.9 48.94,20.45 U7.6 | U7.5 48.85,19.95 49.26,20.36 50.5,20.36 v50.7,20.56
  Bottom 0.2: v33.5,15.04 33.5,15.66 33.8,15.86 33.55,15.99 C36.1 | C37.1 40.68,9.77 v39.6,9.77 | C38.1 40.65,14.1 v39.6,14.1 | C35.1 28.1,13.35 27.34,14.11 v27.34,14.14 | C40.1 40.52,22.11 v39.51,22.11 | C41.1 40.03,27.03 v39.6,26.6 | C42.1 27.85,22.1 v27,22.1 | C43.1 28.05,26.8 v27,26.8 | C33.1 23.3,29.05 v23.3,27.6 | C39.1 29.1,35.4 v29.6,34.9 | v27,9.52 26.5,10.02 C34.1 | v49.68,20.9 49.68,21 49.1,21.58 C3.1 | C19.1 50.7,21.69 v50.7,20.56 50.75,20.51 C20.1
  pour Power (no thermals): 18,37 18,8.2 62,8.2 62,37
3V3_LED_CLK
  Top 0.2: U5.4 57,31.44 U2.2
3V3_LED_DATA
  Top 0.2: U5.3 58.27,30.97 60.12,32.82 U2.1
3V3_RC_SIGNAL
  Top 0.2: U5.2 59.54,29.8 62.56,32.82 U2.0
5V  (via drill 0.35)
  Top 0.2: U2.5V 66,19.45 C2.1 65.85,20.6 65.25,21.2 63,21.2 62.65,21.55 C56.1 61.11,22.2 U5.14 | D9.2 29.3,5.9 v29.4,5.8 D12.C2 | C11.1 34.3,4.1 v33.6,4.8 | R6.2 32.6,5.05 U3.5
  Top 0.5: v33.6,4.8 33.3,5.1 U3.5 32.55,5 v31.7,5
  Power 0.2: U2.5V 66,22.5 66.7,23.2 v68,23.2
  pour Power (no thermals): 8,0 8,7.6 38.4,7.6 38.4,3.6 67,3.6 67,0
  pour Power (no thermals): 62.6,3.2 62.6,19.2 67,19.2 67,3.2
  pour Top (no thermals): 74,28.6 67.5,28.6 67.5,22.2 74,22.2
5V_LED_CLK  (via drill 0.35)
  Top 0.2: U5.11 57,21.11 v56.99,21.1 | v70.39,17.71 J2.2 | v70.4,10.7 J4.2
  Bottom 0.2: v56.99,21.1 57.36,21.1 59.85,18.61 69.49,18.61 v70.39,17.71 v70.39,10.71 v70.4,10.7
5V_LED_DATA  (via drill 0.35)
  Top 0.2: U5.12 58.27,21.13 v58.3,21.1 | J2.3 69.01,18.69 v71,18.69 71,13.2 69.47,11.67 69.03,11.67 J4.3
  Bottom 0.2: v58.3,21.1 60.31,19.09 70.6,19.09 v71,18.69
5V_RC_SIGNAL
  Top 0.2: U5.13 59.54,23.53 60.21,24.2 J1.1
9V  (via drill 0.5)
  Top 0.2: D15.1 61.8,8.3 v62,8.1 | U6.6 64.25,8.2 63.95,8.2 C17.1
  Top 0.5: v62,8.1 62.7,7.4 C17.1 63.05,7.5 U6.4
  pour Top: 64,8.2 26,8.2 26,1.2 64,1.2
+3V3
  pour Power (no thermals): 0,37 0,5.9 7.4,5.9 7.4,8.2 17.4,8.2 17.4,37
+5V
  pour Top (no thermals): 74,8.7 61.4,8.7 61.4,16.2 67.6,16.2 67.6,21.7 74,21.7
+24V
  pour Top: 50,15.7 46,15.7 42.5,12.2 42.5,8.6 47.9,8.6 47.9,10 50,10
CS1
  Top 0.2: U14.7 24.71,14.61 24.95,14.85 27.65,14.85 | 27.65,14.85 U15.2 | 27.65,14.85 29.37,16.57 34.57,16.57 35.52,17.52 U2.14
CS2
  Top 0.2: U16.7 37.29,15.38 | U2.15 38.06,16.15 37.29,15.38 | 37.29,15.38 36.5,14.59 34.03,14.59 33.8,14.36 U15.6
CS3
  Top 0.2: U18.2 35.43,35.45 U2.10 38.06,30.82 37.29,30.05 U17.7
CS4
  Top 0.2: U18.6 27.05,35.95 25.36,34.26 U2.25 25.71,32.47 25.71,27.67 24.71,26.69 U19.7
CS5  (via drill 0.35)
  Top 0.2: U7.10 47.15,20.85 46.97,20.85 45.62,19.51 35.31,19.51 v35,19.2
  Power 0.2: U2.36 16.82,19.2 v35,19.2
DRDY
  Top 0.2: U7.8 48.25,21.13 47.8,21.59 47.75,21.59 47.39,21.94 47.39,22.45 47.75,22.8 50.96,22.8 53,20.75 53,17.88 U2.21
ESC_L
  Top 0.2: J8.1 5.58,21.3 15.2,30.92 U2.29
ESC_R  (via drill 0.35)
  Top 0.2: J7.2 8.8,14.3 11.42,16.92 v11.42,19.22
  Power 0.2: v11.42,19.22 11.42,20.02 21.6,30.2 25.28,30.2 U2.24
ESC_TEL_L
  Top 0.2: J8.2 5.07,20.37 5.67,20.37 17.74,32.44 U2.28
ESC_TEL_R
  Top 0.2: U2.34 7.84,15.3 J7.1
GND  (via drill 0.35)
  Top 0.152: 62.85,19.5 C1.2
  Top 0.2: C2.2 63.46,18.91 U2.GND2 63.46,18.89 62.85,19.5 | J1.3 v70.4,26.2 | v27.02,25.6 26.94,25.69 U19.5 | v27,24.7 26.8,24.9 U19.4 | v27,23.27 25.8,23.27 U19.2 | v39.7,24.5 39.48,24.5 39.09,24.89 U17.4 | U14.5 26.79,13.11 26.9,13 v27,13 | v27,12.1 26.92,12.1 26.71,12.31 U14.4 | U14.2 v27,10.7 | v39.6,10.9 39.4,10.7 U16.2 | v39.51,11.9 39.46,11.9 39.05,12.31 U16.4 | v39.6,12.9 39.39,13.11 U16.5 | v39.7,25.4 39.41,25.69 U17.5 | U17.2 v39.7,23.3 | U15.4 28.55,13.85 v28.5,13.9 | v34.6,36.4 34.55,36.45 U18.4 | D14.C v19,9.2 | D1.C1 v57.9,19.6 | D12.C1 28.09,4.6 v27.99,4.7 28.25,4.7 C14.2 | U13.2 v23.5,31.1 | C11.2 36.45,4.95 v36.7,5.2 | C10.2 35.55,5.85 v35.8,5.6 | C16.2 v65.51,28.2 | v65.41,23.1 64.81,23.1 64.35,22.64 C56.2 | U5.7 v52.3,27.9 | v64.9,14.1 64.85,14.05 C18.2 64.95,12.9 U6.1 | U6.1 65.03,11.42 66.3,11.42 D8.C 66.4,11.12 66.1,10.82 66.1,10.4 v65.9,10.2 U6.7 | U6.7 64,10.55 U6.1 | C17.2 65.8,8.35 v65.8,8.4 65.8,8.9 65.09,9.6 64.6,9.6 U6.7 | D4.2 47.58,8.92 v47.6,8.9 48.99,8.9 U8.3 v50.9,8.8 U8.6 55.59,11.51 v53.2,13.9 52.3,14.8 C4.2 | C6.2 44.2,3.1 44.3,3.2 v45.3,3.2 | v45.3,3.2 46.7,3.2 C7.2 | D6.C1 v45.3,3.2 | D3.C 39.9,6.58 v39.9,5.5 39.88,5.48 D5.C | C21.2 52,18.85 v52,18.3 | v48,20.2 47.75,20.45 | U7.12 47.75,19.95 v48,20.2 | U7.2 48,19.7 v48,20.2 | v48,20.2 48.25,19.95 U7.3 U7.2 | U7.9 47.75,20.45 | U7.12 47.43,19.95 47.75,20.27 47.75,20.45 | U7.2 47.75,19.63 47.42,19.96 47.27,19.96 U7.12 | D7.C 40.71,1.37 v40.71,1.31
  Top 0.3: J4.4 v67.5,12.7 | v70.4,19.7 J2.4
  Top 0.4: U3.2 v31.7,6.5
  Bottom 0.2: C36.2 35.27,16.08 v36.45,16.08 | C38.2 v40.7,11.2 | v42.5,10.9 42.43,10.83 C37.2 | C34.2 24.15,9.92 23.55,9.32 v23.55,8.62 | C35.2 29.15,11.05 v29.2,11 | C41.2 v41.2,24.2 | v43.5,22 C40.2 | C43.2 v28.1,23.9 | v31,22.41 v31,22.4 C42.2 | C33.2 25.11,28.94 v25.11,28 | C39.2 v25.6,35.4 | C19.2 52.55,20.65 v52.4,20.5 52.4,19.45 C20.2 | C3.2 48.05,23.75 v48,23.8
  other vias: 1.2,17.8
  pour GND (no thermals): 74,37 0,37 0,0 74,0
  pour Top (no thermals): 0.3,12.4 2.1,12.4 2.1,23.2 0.3,23.2
INT  (via drill 0.35)
  Top 0.2: U7.7 48.65,21.05 48.65,21.23 48,21.88 v48,22.19
  Bottom 0.2: v48,22.19 48,21.59 48.97,20.62 48.97,19.81 50.76,18.02 U2.20
MISO  (via drill 0.35)
  Top 0.2: U17.12 35.51,23.29 34.8,24 v34.8,25.3 | U19.12 22.91,23.29 22.6,23.6 v22.4,23.6 | U16.12 35.1,10.7 v35,10.8 | v21.2,9.9 21.27,9.97 21.27,14.02 | 21.27,14.02 21.27,20.77 v21.3,20.8 | U14.12 23.01,10.71 22.53,11.19 22.53,12.76 21.27,14.02
  Bottom 0.2: U2.12 32.77,32.23 32.77,28.53 | 32.77,28.53 32.77,27.33 v34.8,25.3 | 32.77,28.53 32.24,28 26.79,28 v22.4,23.61 v22.4,23.6 21.6,22.8 21.6,21.1 v21.3,20.8 | v35,10.8 32.92,10.8 30.07,7.94 23.17,7.94 v21.21,9.9 v21.2,9.9
MOSI  (via drill 0.35)
  Top 0.2: U18.5 31.33,36.45 32.91,34.87 33.42,34.87 U18.1 34.85,34.95 35.52,34.28 U2.11 | U15.5 31.24,13.85 30.57,14.52 30.57,15.01 30.24,15.35 U15.1 29.7,15.35 30.25,15.9 v30.7,15.9
  Bottom 0.2: v30.7,15.9 30.7,16.22 31.63,17.15 31.63,18.01 35.52,21.9 U2.11
MOSI1  (via drill 0.35)
  Top 0.2: U15.7 v31.26,14.85 v31.26,14.86 | U14.13 22.81,9.91 21.9,10.82 v21.9,12.5
  Bottom 0.2: v31.26,14.86 24.26,14.86 v21.9,12.5
MOSI2
  Top 0.2: U15.3 30.1,14.35 31.1,13.35 31.45,13.35 34.89,9.91 U16.13
MOSI3
  Top 0.2: U18.7 30.82,35.33 31.89,35.33 34.17,33.05 34.17,23.34 35.02,22.49 U17.13
MOSI4  (via drill 0.35)
  Top 0.2: U18.3 32.72,35.95 v32.19,36.48 | v21.53,26.13 21.53,23.57 22.61,22.49 U19.13
  Bottom 0.2: v32.19,36.48 31.9,36.2 22.9,36.2 21.53,34.83 v21.53,26.13
N$5
  Top 0.2: U7.4 49.7,19.45 C21.1
N$8
  Top 0.2: U3.4 C14.1
N$14
  Top 0.2: R8.1 66.45,13.13 D8.A
N$15
  Top 0.2: D7.A 37.77,1.85 R6.1
N$18
  Top 0.2: D5.A 38.12,3.92 39.07,2.97 40.98,2.97 R4.1
N$19
  Top 0.2: R2.1 38.15,6.63 D3.A
N$20
  Top 0.2: R1.1 39.95,8 R2.2
N$27
  Top 0.2: D14.A R11.1
SCL
  Top 0.2: U7.1 47.25,18.55 U2.19
SCLK  (via drill 0.35)
  Top 0.2: U14.14 v24.7,8.6 | U2.13 32.98,20.28 33,20.3 | U17.14 37.29,21.99 36,20.7 33.4,20.7 33,20.3 | U19.14 24.71,21.99 26,20.7 32.6,20.7 33,20.3 | 33,20.3 | v32.58,11.32 32.68,11.32 34.67,9.32 37.1,9.32 37.29,9.51 U16.14
  Bottom 0.2: U2.13 32.58,17.18 v32.58,11.32 29.93,8.67 24.77,8.67 v24.7,8.6
SDA
  Top 0.2: U7.11 47.07,20.45 45.68,19.06 U2.18
TEMP
  Top 0.2: U13.3 22.75,32.75 U2.26

### Text on the board
tPlace: 3V3 | 3.3V | 24V | 5V | 9V | Hockii | 5V
bPlace: Hockii Control V1
tDocu: +